# Altium schematic sheet Power.SchDoc
size A4
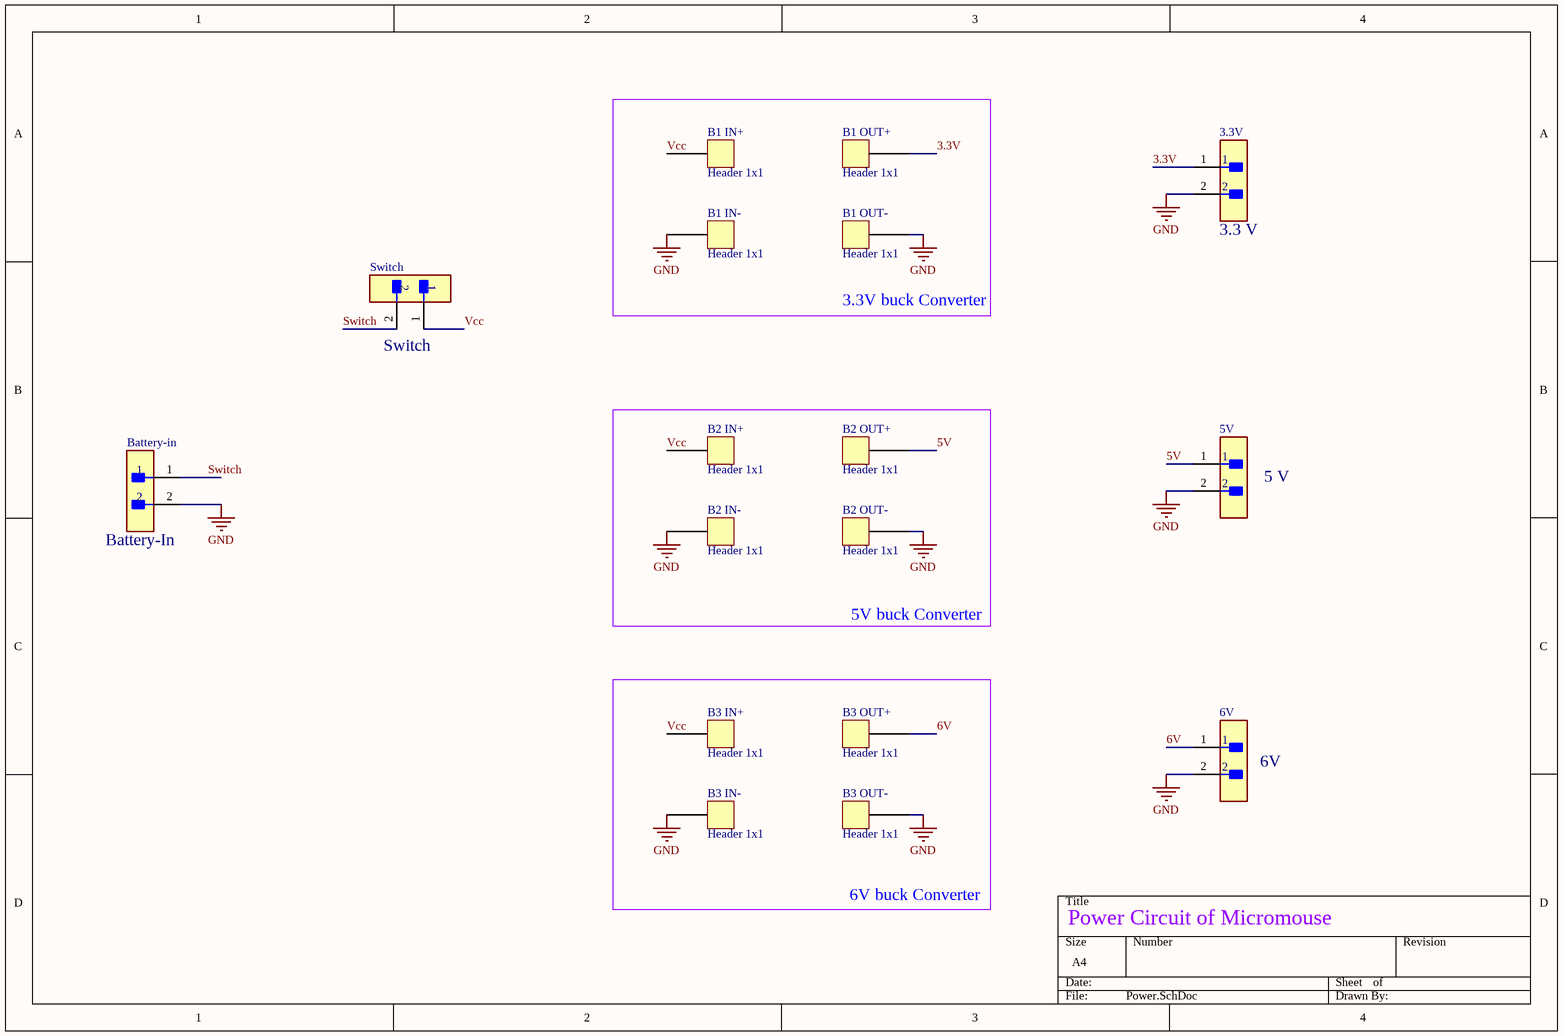
[diagram p0: Power.SchDoc]

## Parts
3.3V  3.3 V  [FP-B2B-XH-A_LF_SN-MFG]
5V  5 V  [FP-B2B-XH-A_LF_SN-MFG]
6V  6V  [FP-B2B-XH-A_LF_SN-MFG]
B1_IN+  Header 1x1  [Header 1x1 long]
B1_IN-  Header 1x1  [Header 1x1 long]
B1_OUT+  Header 1x1  [Header 1x1 long]
B1_OUT-  Header 1x1  [Header 1x1 long]
B2_IN+  Header 1x1  [Header 1x1 long]
B2_IN-  Header 1x1  [Header 1x1 long]
B2_OUT+  Header 1x1  [Header 1x1 long]
B2_OUT-  Header 1x1  [Header 1x1 long]
B3_IN+  Header 1x1  [Header 1x1 long]
B3_IN-  Header 1x1  [Header 1x1 long]
B3_OUT+  Header 1x1  [Header 1x1 long]
B3_OUT-  Header 1x1  [Header 1x1 long]
Battery-in  Battery-In  [FP-B2B-XH-A_LF_SN-MFG]
Switch  Switch  [FP-B2B-XH-A_LF_SN-MFG]

## Blocks framed on the sheet
3.3V buck Converter: B1_IN+ B1_IN- B1_OUT+ B1_OUT-
5V buck Converter: B2_IN+ B2_IN- B2_OUT+ B2_OUT-
6V buck Converter: B3_IN+ B3_IN- B3_OUT+ B3_OUT-

## Nets
GND: 3.3V.2 5V.2 6V.2 B1_IN-.1 B1_OUT-.1 B2_IN-.1 B2_OUT-.1 B3_IN-.1 B3_OUT-.1 Battery-in.2
3.3V: 3.3V.1 B1_OUT+.1
5V: 5V.1 B2_OUT+.1
6V: 6V.1 B3_OUT+.1
Switch: Battery-in.1 Switch.2
Vcc: B1_IN+.1 B2_IN+.1 B3_IN+.1 Switch.1

## Notes on the sheet
- Power Circuit of Micromouse

## Library data of the parts
3.3V 5V 6V Battery-in Switch = CMP-2000-05888-3: CONN HEADER VERT 2POS 2.5MM; Current Rating: 3A; Voltage Rating: 250V; Number of Contacts: 2; Contact Resistance: 20mR; Wire/Cable Gauge: 22AWG; Insulation Resistance: 1GR; Connector Type: Male Pin; Packaging: Bulk; Contact Material: Brass; Lead Free: Lead Free; Orientation: Straight; Contact Plating: Tin; Max Current Rating: 3A; Termination: Solder; Fastening Type: Detent; Depth: 5.75mm; Housing Material: Polyamide; REACH SVHC: No SVHC; Series: XH; Voltage Rating (AC): 250V; Number of Positions: 2; Color: Natural; Contact Type: Male Pin; Max Voltage Rating (DC): 250V; Pitch: 2.5mm; Lead Pitch: 2.5mm; Mount: Through Hole; Max Operating Temperature: 85°C; Length: 7.4mm; Max Voltage Rating (AC): 250V; Min Operating Temperature: -25°C; Number of Rows: 1; Housing Color: White